# Altium schematic sheet LD_driver.SchDoc
size 420 x 297 mm; Address1: Address1; Address2: Address2; Address3: Address3; Address4: Address4; DocumentNumber: *Э3; SheetNumber: 5; SheetTotal: 10; DocumentType: Схема электрическая *
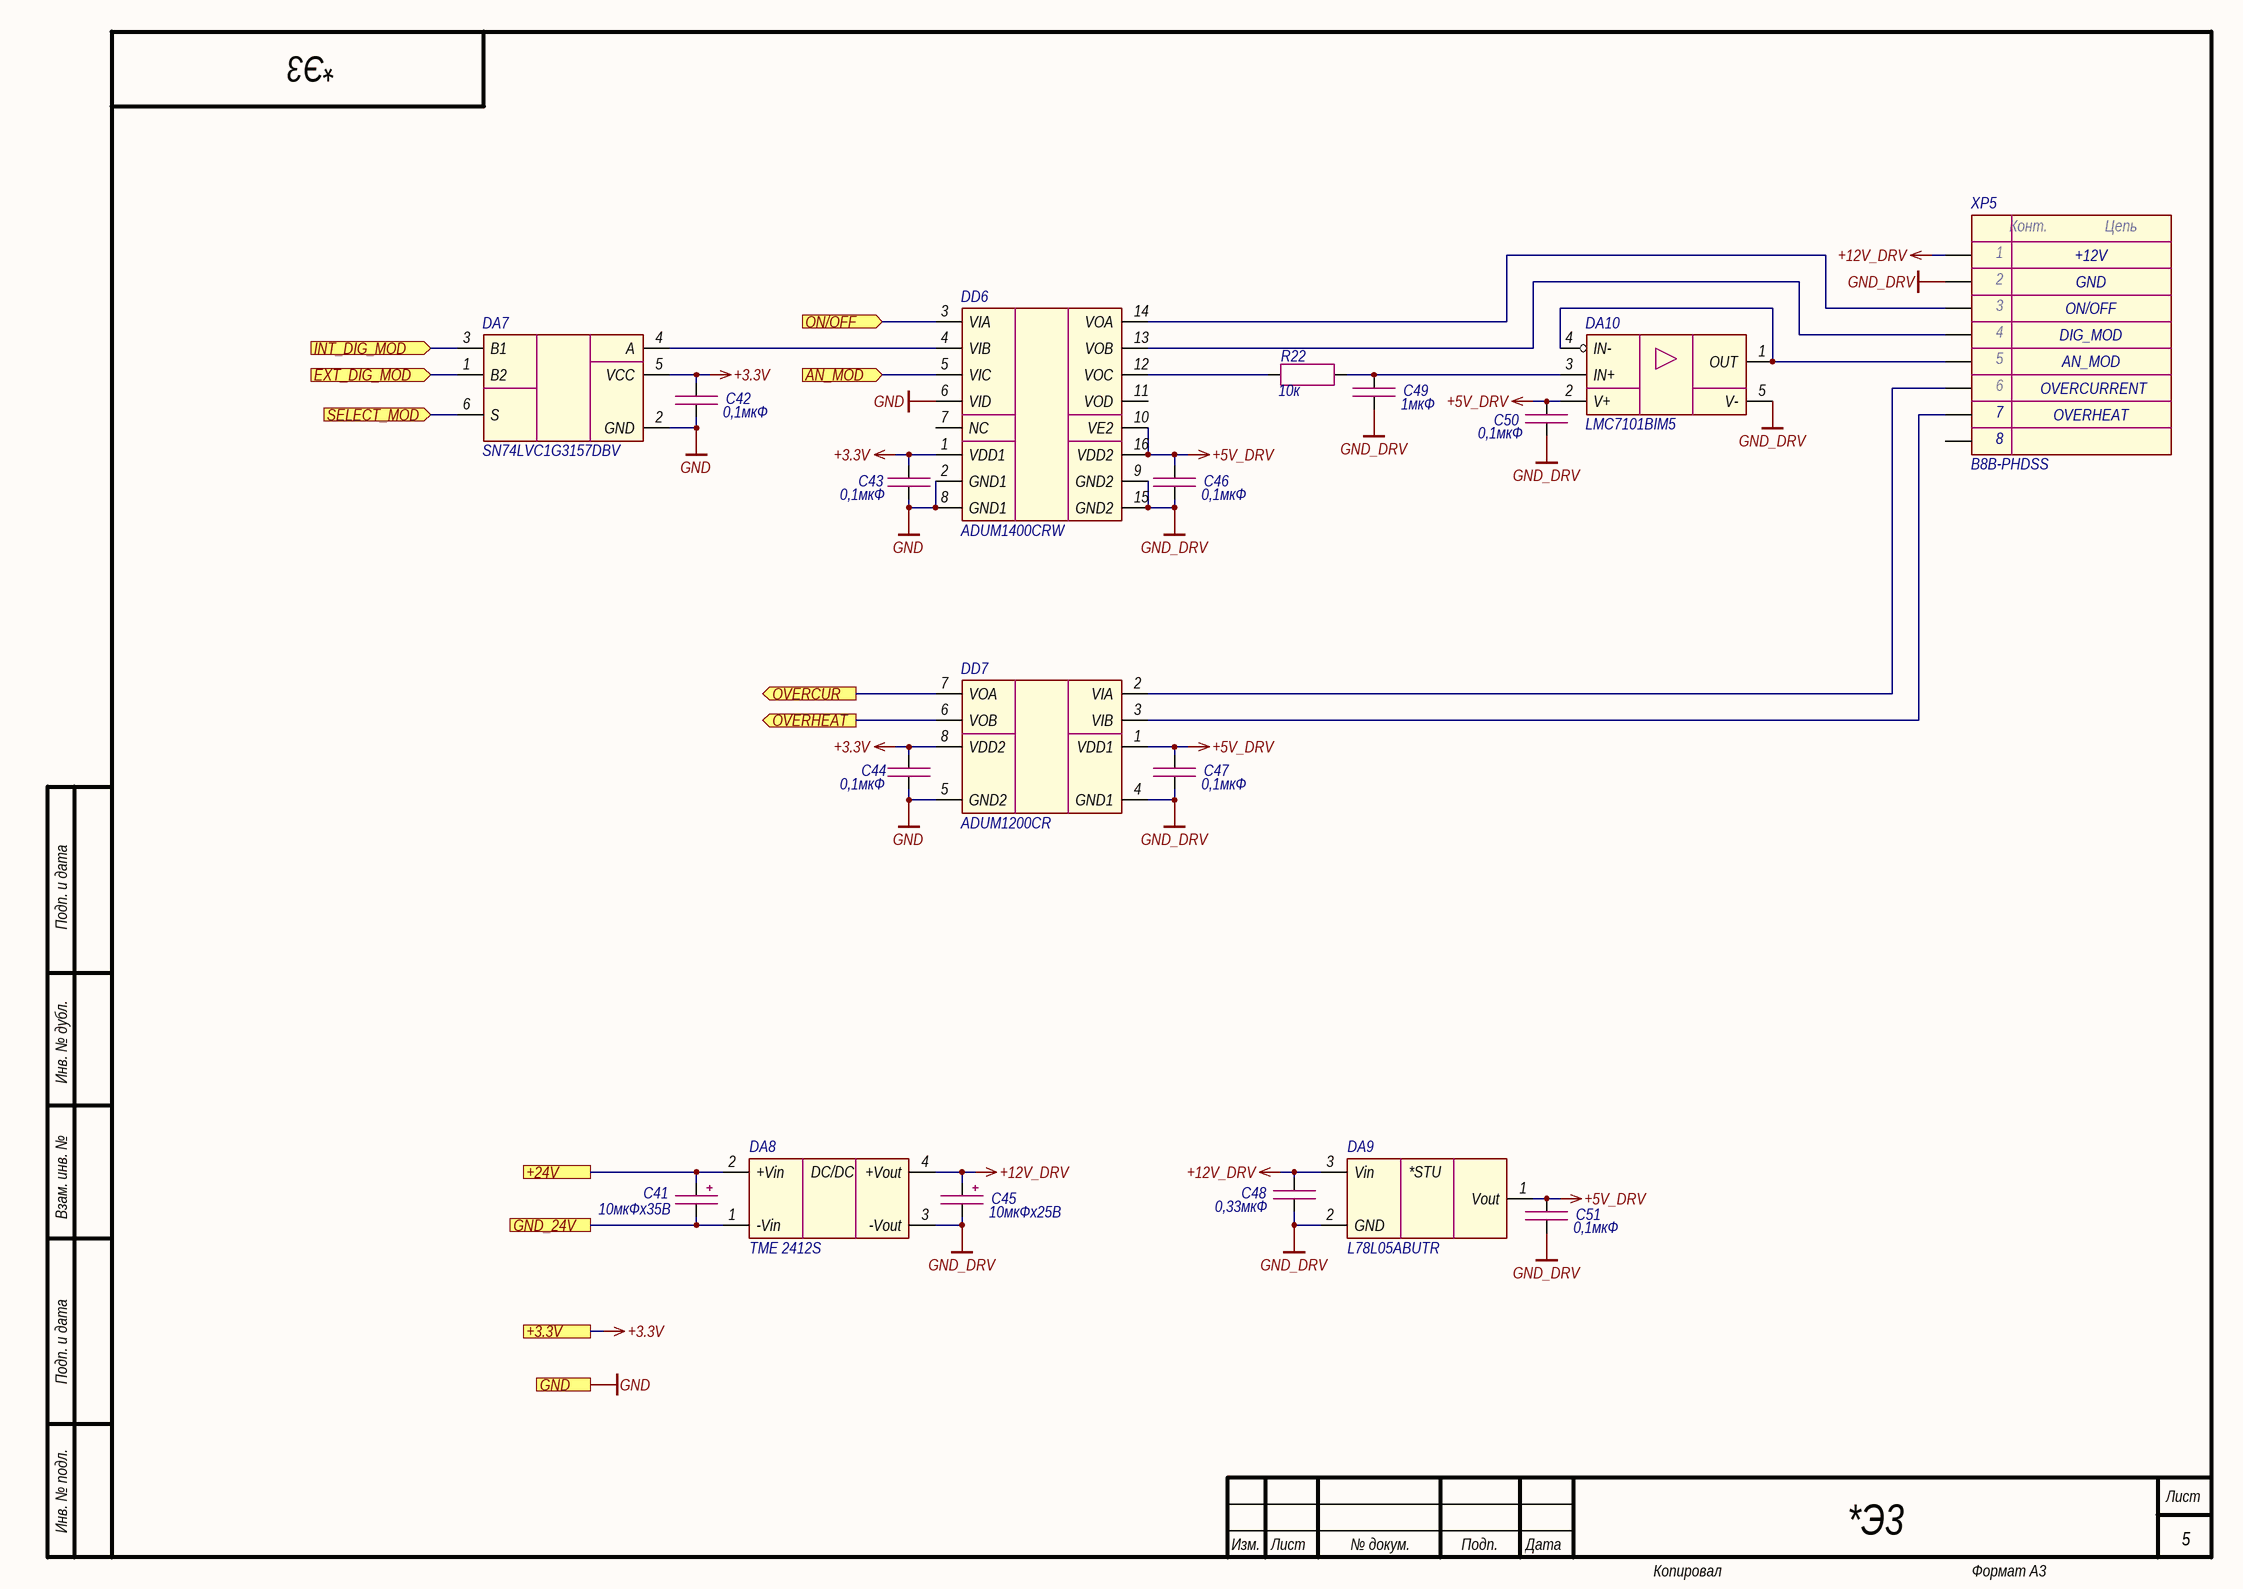
[diagram p0: LD_driver.SchDoc]

## Parts
C41  10мкФх35B  [CAP_C]
C42  0,1мкФ  [CAP_0603]
C43  0,1мкФ  [CAP_0603]
C44  0,1мкФ  [CAP_0603]
C45  10мкФх25B  [CAP_B]
C46  0,1мкФ  [CAP_0603]
C47  0,1мкФ  [CAP_0603]
C48  0,33мкФ  [CAP_0805]
C49  1мкФ  [CAP_0603]
C50  0,1мкФ  [CAP_0603]
C51  0,1мкФ  [CAP_0603]
DA7  SN74LVC1G3157DBV  [SOT-23-6]
DA8  TME 2412S  [TME (SIP-4)]
DA9  L78L05ABUTR  [SOT-89]
DA10  LMC7101BIM5  [SOT-23-5]
DD6  ADUM1400CRW  [SOIC-16W]
DD7  ADUM1200CR  [SOIC-8]
R22  10к  [RES_0603]
XP5  B8B-PHDSS  [B8B-PHDSS]

## Ports
+3.3V (see Main[2C], Ethernet[3D], Fiber_interlock[2C], Hardwiring[3D], Power_supply[1D]), +24V (see Main[2C], Hardwiring[3C], Indication[1C], Power_supply[1D]), AN_MOD (in, see Main[1C]), EXT_DIG_MOD (in, see Main[1C]), GND (see Main[2C], Ethernet[3D], Fiber_interlock[2C], Guide_laser[1C], Hardwiring[3D], Indication[1C], Power_supply[1D]), GND_24V (see Main[2C], Hardwiring[3C], Indication[1C], Power_supply[1D]), INT_DIG_MOD (in, see Main[1C]), ON/OFF (in, see Main[1B]), OVERCUR (out, see Main[2B]), OVERHEAT (out, see Main[2B]), SELECT_MOD (in, see Main[1C])

## Nets
+3.3V: C42.1 C43.1 C44.1 DA7.5(VCC) DD6.1(VDD1) DD7.8(VDD2) ; port +3.3V
+5V_DRV: C46.1 C47.1 C50.1 C51.1 DA9.1(Vout) DA10.2(V+) DD6.10(VE2) DD6.16(VDD2) DD7.1(VDD1)
+12V_DRV: C45.1 C48.2 DA8.4(+Vout) DA9.3(Vin) XP5.1
GND: C42.2 C43.2 C44.2 DA7.2(GND) DD6.2(GND1) DD6.6(VID) DD6.8(GND1) DD7.5(GND2) ; port GND
GND_DRV: C45.2 C46.2 C47.2 C48.1 C49.2 C50.2 C51.2 DA8.3(-Vout) DA9.2(GND) DA10.5(V-) DD6.9(GND2) DD6.15(GND2) DD7.4(GND1) XP5.2
+24V: C41.1 DA8.2(+Vin) ; port +24V
AN_MOD: DD6.5(VIC) ; port AN_MOD
EXT_DIG_MOD: DA7.1(B2) ; port EXT_DIG_MOD
GND_24V: C41.2 DA8.1(-Vin) ; port GND_24V
INT_DIG_MOD: DA7.3(B1) ; port INT_DIG_MOD
ON/OFF: DD6.3(VIA) ; port ON/OFF
OVERCUR: DD7.7(VOA) ; port OVERCUR
OVERHEAT: DD7.6(VOB) ; port OVERHEAT
SELECT_MOD: DA7.6(S) ; port SELECT_MOD
NetC49_1: C49.1 DA10.3(IN+) R22.2
NetDA7_4: DA7.4(A) DD6.4(VIB)
NetDA10_1: DA10.1(OUT) DA10.4(IN-) XP5.5
NetDD6_12: DD6.12(VOC) R22.1
NetDD6_13: DD6.13(VOB) XP5.4
NetDD6_14: DD6.14(VOA) XP5.3
NetDD7_2: DD7.2(VIA) XP5.6
NetDD7_3: DD7.3(VIB) XP5.7

Not connected (* = marked no-connect by the designer): DD6 7(NC) 11(VOD); XP5 8

## Notes on the sheet
- +12V
- ON/OFF
- DIG_MOD
- GND
- AN_MOD
- OVERCURRENT
- OVERHEAT
- Подп. и дата
- Инв. № дубл.
- Взам. инв. №
- Инв. № подл.
- Изм.
- Лист
- № докум.
- Подп.
- Дата
- Копировал
- Формат А3
- (in symbol Connector-8) Конт.; Цепь
- (in symbol LD2981ABU50TR) *STU
- (in symbol TME) DC/DC

## Library data of the parts
C41 = Capacitor_Polar: Model: TECAP, 10 мкФ, 35 В, тип C, 10%; Value: 10мкФх35B; Document: *; Manufacturer: *
C42-C44 C46 C47 C50 C51 = Capacitor: Manufacturer: Murata; Model: GRM188R71H104KA93D; Value: 0,1мкФ; Document: *
C45 = Capacitor_Polar: Model: TECAP, 10 мкФ, 25 В, тип B, 10%; Value: 10мкФх25B; Document: *; Manufacturer: *
C48 = Capacitor: Manufacturer: Murata; Model: GRM219R71H334KA88D; Value: 0,33мкФ; Document: *
C49 = Capacitor: Manufacturer: Murata; Model: GRM188R61H105KAALD; Value: 1мкФ; Document: *
DA7 = SN74LVC1G3157: Manufacturer: Texas Instruments; Model: SN74LVC1G3157DBV; Document: *
DA8 = TME: Manufacturer: Traco Power; Model: TME 2412S; Document: *
DA9 = LD2981ABU50TR: Manufacturer: STMicroelectronics; Model: L78L05ABUTR; Document: *
DA10 = LMC7101: Manufacturer: Texas Instruments; Model: LMC7101BIM5; Document: *
DD6 = ADUM1400: Manufacturer: Analog Devices; Model: ADUM1400CRW; Document: *
DD7 = ADUM1200: Manufacturer: Analog Devices; Model: ADUM1200CR; Document: *
R22 = Resistor: Manufacturer: Yageo; Model: RC0603FR-0710KL; Value: 10к; Document: *
XP5 = Connector-8: Manufacturer: JST; Model: B8B-PHDSS; Document: *